# EasyEDA Pro project STLink.eprj

# Schematic Schematic1
Board Name: TYPEC; Create Date: 2025-10-18; Page Name: P1; Project Name: STLink; Schematic Name: Schematic1; Update Date: 2025-10-19; Company: 嘉立创EDA; Page Size: A3; Version: V1.0
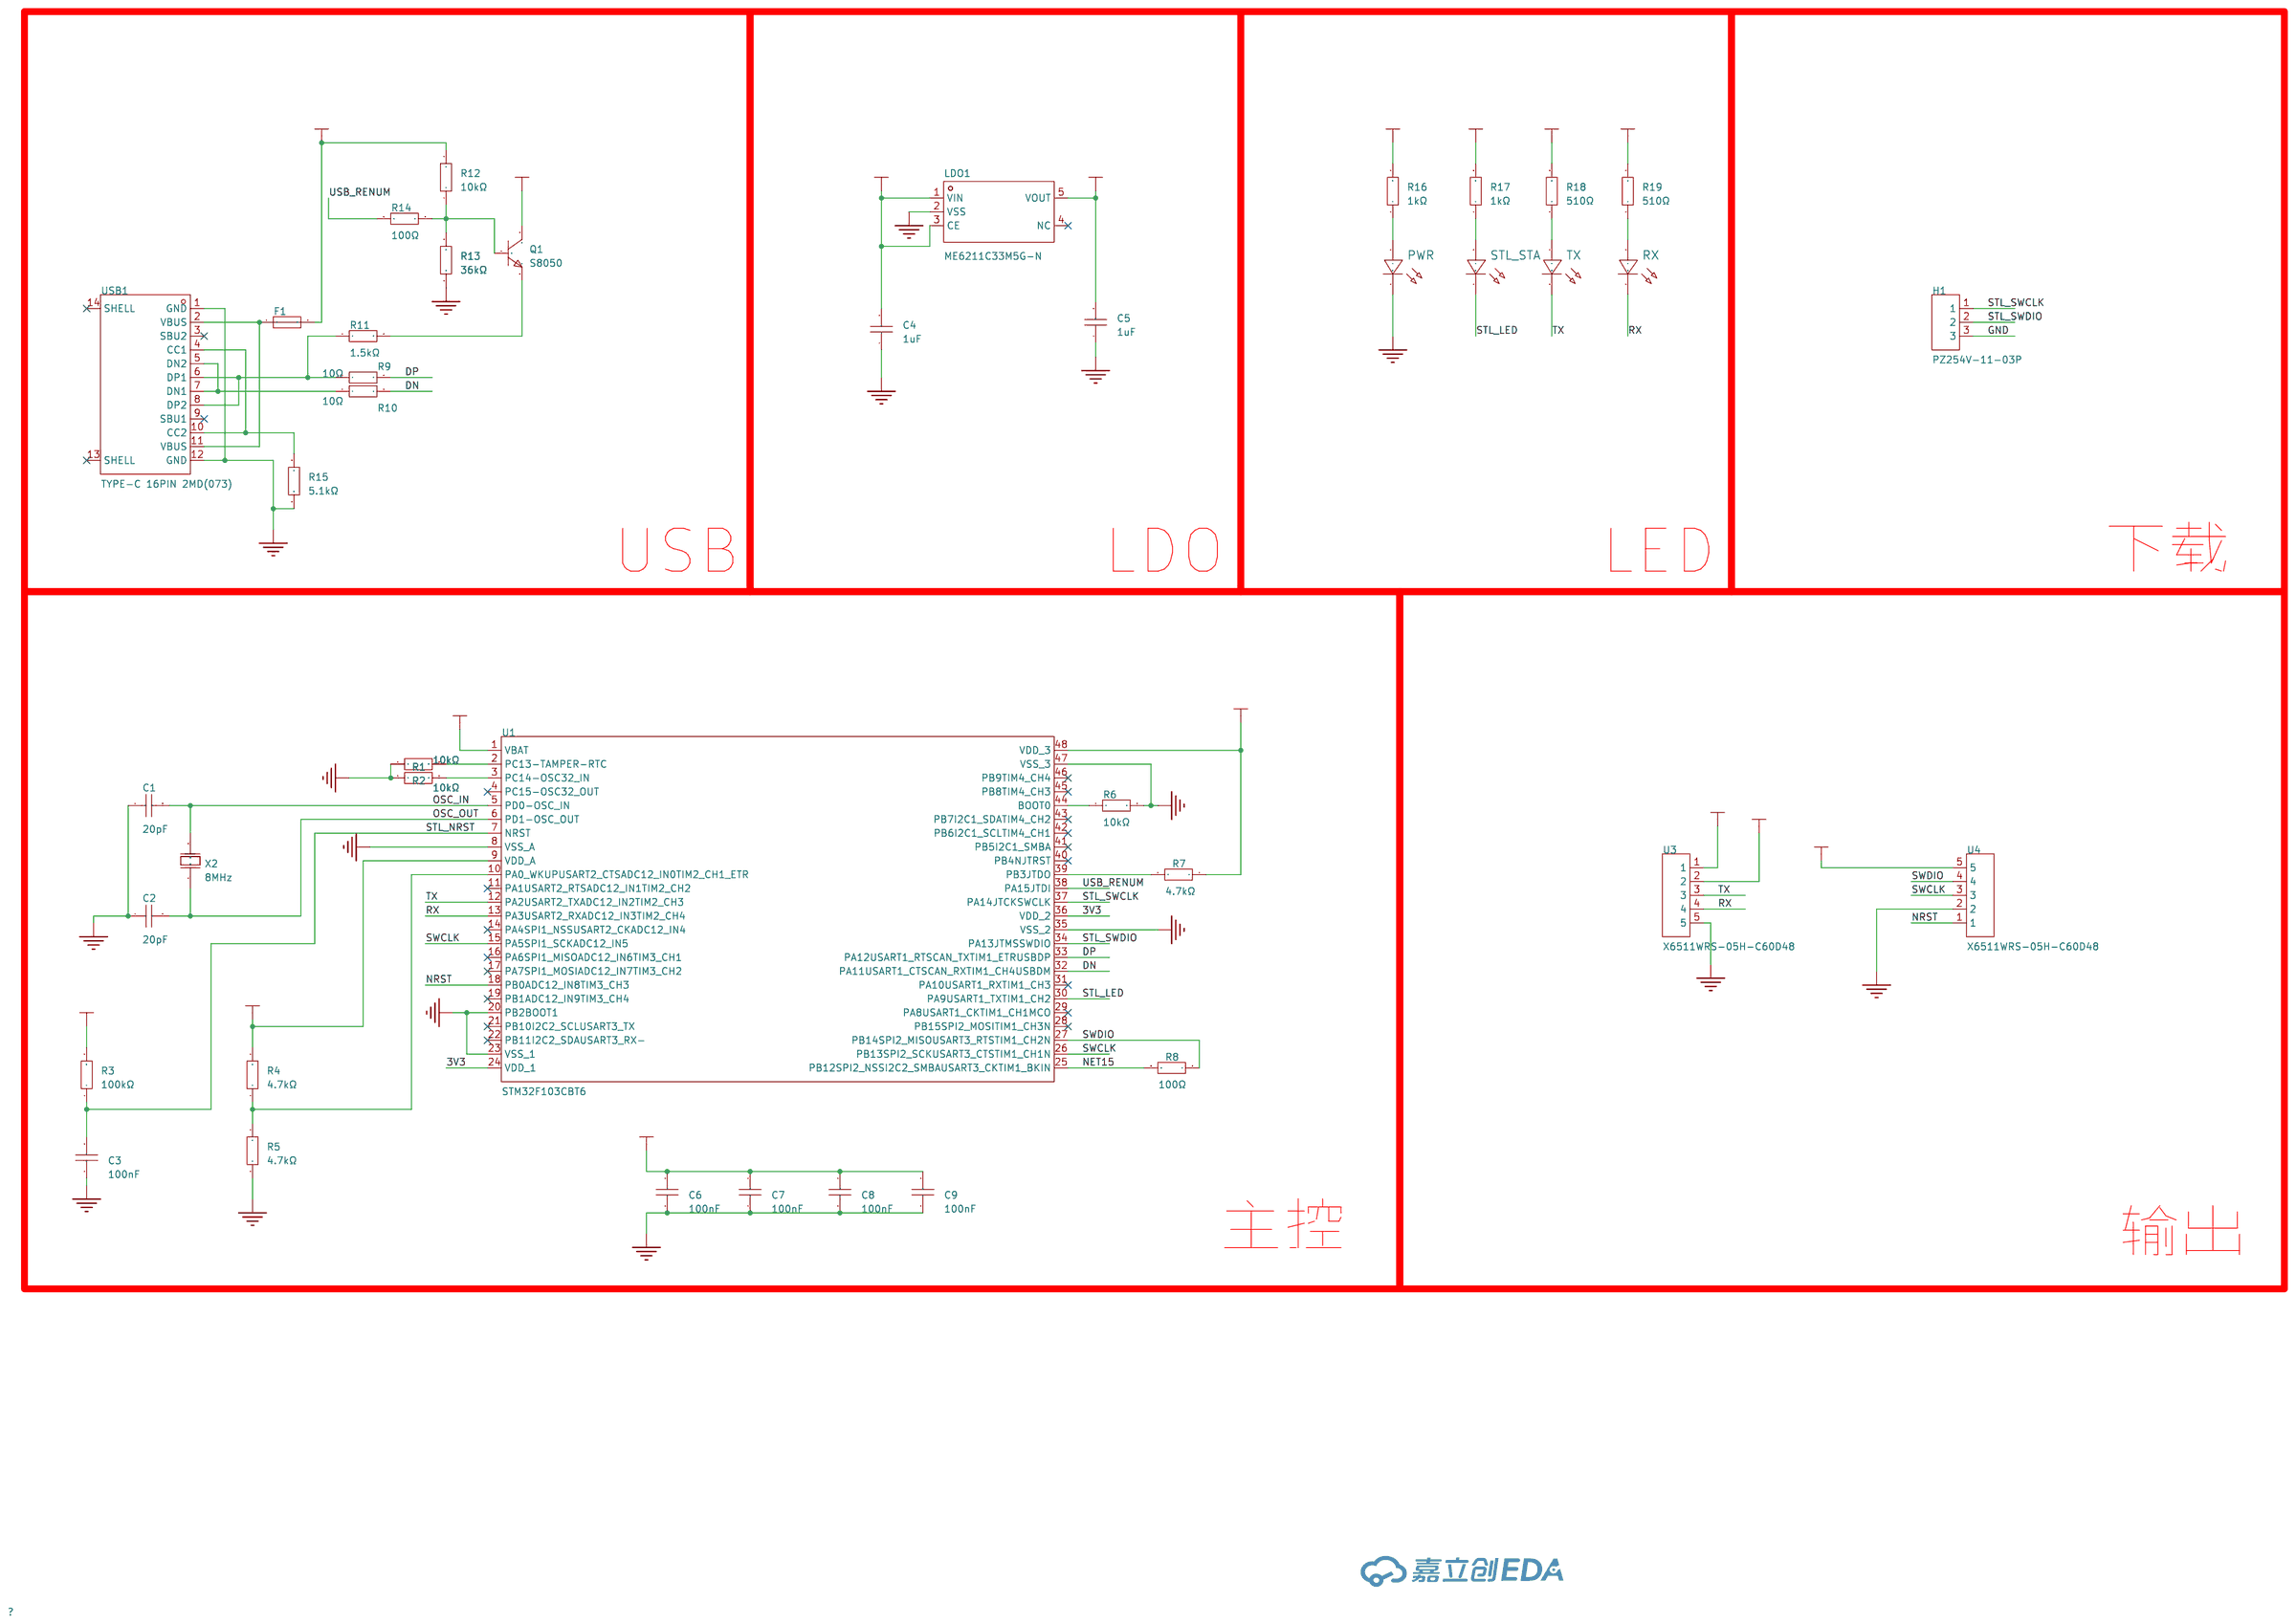
[diagram p0: schematic sheet]

## Parts
C1  20pF  [C0402]
C2  20pF  [C0402]
C3  100nF  [C0402]
C4  1uF  [C0603]
C5  1uF  [C0603]
C6  100nF  [C0402]
C7  100nF  [C0402]
C8  100nF  [C0402]
C9  100nF  [C0402]
F1  MF-FSMF050X-2  [F0603]
H1  PZ254V-11-03P  [HDR-TH_3P-P2.54-V-M]
LDO1  ME6211C33M5G-N  [SOT-23-5_L3.0-W1.7-P0.95-LS2.8-BR]
PWR  -  [LED_0603]
Q1  S8050  [SOT-23-3_L3.0-W1.7-P0.95-LS2.9-BR]
R1  10kΩ  [R0402]
R2  10kΩ  [R0402]
R3  100kΩ  [R0402]
R4  4.7kΩ  [R0402]
R5  4.7kΩ  [R0402]
R6  10kΩ  [R0402]
R7  4.7kΩ  [R0402]
R8  100Ω  [R0402]
R9  10Ω  [R0402]
R10  10Ω  [R0402]
R11  1.5kΩ  [R0402]
R12  10kΩ  [R0402]
R13  36kΩ  [R0402]
R14  100Ω  [R0402]
R15  5.1kΩ  [R0402]
R16  1kΩ  [R0402]
R17  1kΩ  [R0402]
R18  510Ω  [R0402]
R19  510Ω  [R0402]
RX  -  [LED_0603]
STL_STA  -  [LED_0603]
TX  -  [LED_0603]
U1  STM32F103CBT6  [LQFP-48_L7.0-W7.0-P0.50-LS9.0-BL]
U3  X6511WRS-05H-C60D48  [HDR-SMD_5P-P2.54-H-M-W13.3-N]
U4  X6511WRS-05H-C60D48  [HDR-SMD_5P-P2.54-H-M-W13.3-N]
USB1  TYPE-C 16PIN 2MD(073)  [USB-C-SMD_TYPE-C-6PIN-2MD-073]
X2  8MHz  [HC-49US_L11.5-W4.5-P4.88]

## Library data of the parts
C1-C3 C6-C9 = CC0402KRX7R9BB103: LCSC Part Name: 10nF ±10% 50V; Supplier Part: C60133; Manufacturer: YAGEO(国巨); Supplier Footprint: 0402; JLCPCB Part Class: 扩展库; Datasheet: https://atta.szlcsc.com/upload/public/pdf/source/20180224/C181747_15194369449651363981.pdf; Supplier: LCSC; Tolerance: ±10%; Voltage Rated: 50V; Temperature Coefficient: X7R
C4 C5 = CL10A105KB8NNNC: 温度系数:X5R;精度:±10%;额定电压:50V;容值:1uF;; LCSC Part Name: 1uF(105) ±10% 50V; Supplier Part: C15849; Manufacturer: SAMSUNG(三星); Supplier Footprint: 0603; JLCPCB Part Class: Basic Part; Datasheet: https://atta.szlcsc.com/upload/public/pdf/source/20160103/1457707679084.pdf; Supplier: LCSC; Tolerance: ±10%; Voltage Rated: 50V; Temperature Coefficient: X5R
F1 = MF-FSMF050X-2: LCSC Part Name: 6V 500mA; Supplier Part: C210357; Manufacturer: BOURNS; Supplier Footprint: 0603; JLCPCB Part Class: Extended Part; Datasheet: https://atta.szlcsc.com/upload/public/pdf/source/20180524/C210357_26D2BEEFC098B5962B9D8AEB60E1F9FC.pdf; Supplier: LCSC; Operating Voltage (Max): 6V; Current Rating (Max): 40A; Hold Current: 500mA; Trip Current: 1A; Resistance - Initial (Ri) (Min): 100mΩ; Resistance - Post Trip (R1) (Max): 800mΩ; Maximum Time to Trip: 100ms; Operating Temperature: -40℃~+85℃
H1 = PZ254V-11-03P: LCSC Part Name: 1x3P 间距:2.54mm 方针 直插; Supplier Part: C2937625; Manufacturer: XFCN(兴飞); Supplier Footprint: 插件,P=2.54mm; JLCPCB Part Class: 扩展库; Datasheet: https://item.szlcsc.com/datasheet/PZ254V-11-03P/3293280.html; Supplier: LCSC; Pin Structure: 1x3P; Pitch: 2.54mm; Circluar Pins/Square Pins: 方针; Mounting Type: 直插; Number of Rows: 单排; Number of Pins: 3P; Current Rating: 3A; Voltage Rating (Max): 250V; Length of Mating Pin: 6mm; Insulation Height: 2.5mm; Length of End Connection Pin: 3mm; Operating Temperature: -40℃~+105℃; Color: 黑色
LDO1 = ME6211C33M5G-N: 输出类型:固定;输出极性:正;输出通道数:1;最大输入电压:6V;输出电压:3.3V;压差:260mV@(200mA);输出电流:500mA;电源纹波抑制比(PRSS):70dB@(1kHz),62dB@(10kHz);; LCSC Part Name: Vin=6V Vout=3.3V 500mA 70dB@(1kHz),62dB@(10kHz); Supplier Part: C82942; Manufacturer: MICRONE(南京微盟); Supplier Footprint: SOT-23-5; JLCPCB Part Class: Extended Part; Datasheet: https://atta.szlcsc.com/upload/public/pdf/source/20170918/C82942_1505727073070976520.pdf; Supplier: LCSC; Output Type: 固定; Maximum Input Voltage: 6V; Output Voltage: 3.3V; Dropout Voltage: 260mV@(200mA); Output Polarity: 正; Number of Outputs: 1; Output Current: 500mA; Power Supply Rejection Ratio (PRSS): 70dB@(1kHz),62dB@(10kHz)
PWR RX STL_STA TX = LED_0603-R: Supplier Footprint: 0603
Q1 = S8050_C364312: LCSC Part Name: hFE:200-350 NPN 电流:500mA 电压:25V; Supplier Part: C364312; Manufacturer: MDD(辰达半导体); Supplier Footprint: SOT-23; JLCPCB Part Class: 扩展库; Datasheet: https://item.szlcsc.com/datasheet/S8050/338624.html; Supplier: LCSC; type: NPN; Current - Collector(Ic): 500mA; Collector - Emitter Voltage VCEO: 25V; Pd - Power Dissipation: 300mW; Transition frequency(fT): 150MHz; Current - Collector Cutoff: 100nA; Vce Saturation(VCE(sat)): 600mV@500mA,50mA; Operating Temperature: -55℃~+150℃; Emitter-Base Voltage(Vebo): 5V
R1-R19 = 0402WGF1001TCE: LCSC Part Name: 1kΩ ±1% 62.5mW 厚膜电阻; Supplier Part: C11702; Manufacturer: UNI-ROYAL(厚声); Supplier Footprint: 0402; JLCPCB Part Class: 基础库; Datasheet: https://item.szlcsc.com/datasheet/0402WGF1001TCE/12256.html; Supplier: LCSC; Type: 厚膜电阻; Tolerance: ±1%; Power(Watts): 62.5mW; Voltage-Supply(Max): 50V; Temperature Coefficient: ±100ppm/℃; Operating Temperature: -55℃~+155℃
U1 = STM32F103CBT6: LCSC Part Name: 主流增强型ARM Cortex-M3 MCU，具有128 KB Flash、72 MHz CPU、电机控制、USB和CAN; Supplier Part: C8304; Manufacturer: ST(意法半导体); Supplier Footprint: LQFP-48(7x7); JLCPCB Part Class: 扩展库; Datasheet: https://item.szlcsc.com/datasheet/STM32F103CBT6/8796.html; Supplier: LCSC; CPU Core: ARM-M3; CPU Maximum Speed: 72MHz; Program Storage Size: 128KB; Program Memory Type: FLASH; Number of I/O: 37; ADC (Bit): 12bit; Voltage - Supply: 2V~3.6V
U3 U4 = X6511WRS-05H-C60D48: LCSC Part Name: 1x5P 间距:2.54mm 方针; Supplier Part: C5242198; Manufacturer: XKB Connection(中国星坤); Supplier Footprint: SMD,P=2.54mm,卧贴; JLCPCB Part Class: 扩展库; Datasheet: https://item.szlcsc.com/datasheet/X6511WRS-05H-C60D48/5950305.html; Supplier: LCSC; Pin Structure: 1x5P; Pitch: 2.54mm; Row Spacing: 2.54mm; Circluar Pins/Square Pins: 方针; Number of Rows: 单排; Number of Pins: 5P; Current Rating: 3A; Voltage Rating (Max): 250V; Insulation Height: 2.5mm; Contact Material: 黄铜; Contact Plating: 金; Operating Temperature: -40℃~+105℃; Color: 黑色
USB1 = TYPE-C 16PIN 2MD(073): LCSC Part Name: Type-C 母 卧贴; Supplier Part: C2765186; Manufacturer: SHOU HAN(首韩); Supplier Footprint: SMD; JLCPCB Part Class: 扩展库; Datasheet: https://item.szlcsc.com/datasheet/TYPE-C%252016PIN%25202MD(073)/2901843.html; Supplier: LCSC; Connector Type: Type-C; Gender: 母; Mounting Type: 卧贴; Number of Contacts: 16P; Number of Ports: 1; Current Rating-Power: 3A; Voltage Rating: 5V; Connect-Disconnect Life: 5千次; Detection color: 黑色; Operating Temperature: -25℃~+85℃
X2 = X49SD8MSB2SI: LCSC Part Name: HC-49US 8MHZ 2P 49S 20PF ±10PPM -40~85℃（±30PPM); Supplier Part: C188205; Manufacturer: YXC(扬兴晶振); Supplier Footprint: HC-49S; JLCPCB Part Class: 扩展库; Datasheet: https://item.szlcsc.com/datasheet/X49SD8MSB2SI/199611.html; Supplier: LCSC; Type: 直插晶振; Normal temperature Frequency Tolerance: ±10ppm; Load Capacitance: 20pF; Frequency Stability: ±30ppm; Operating Temperature: -40℃~+85℃

## Nets
3V3: C5.2 C6.2 C7.2 C8.2 C9.2 LDO1.5(VOUT) Q1.3(C) R3.2 R4.2 R7.1 R16.2 R17.2 R18.2 R19.2 U1.1(VBAT) U1.9(VDD_A) U1.24(VDD_1) U1.36(VDD_2) U1.48(VDD_3) U3.2 U4.5
5V: C4.2 F1.2 LDO1.1(VIN) LDO1.3(CE) R12.2 U3.1
GND: C1.1 C2.1 C3.1 C4.1 C5.1 C6.1 C7.1 C8.1 C9.1 H1.3 LDO1.2(VSS) PWR.1(C) R1.1 R2.1 R5.1 R6.2 R13.1 R15.1 U1.8(VSS_A) U1.20(PB2BOOT1) U1.23(VSS_1) U1.35(VSS_2) U1.47(VSS_3) U3.5 U4.2 USB1.1(GND) USB1.12(GND)
DN: R10.2 U1.32(PA11USART1_CTSCAN_RXTIM1_CH4USBDM)
DP: R9.2 U1.33(PA12USART1_RTSCAN_TXTIM1_ETRUSBDP)
NET15: R8.2 U1.25(PB12SPI2_NSSI2C2_SMBAUSART3_CKTIM1_BKIN)
NRST: U1.18(PB0ADC12_IN8TIM3_CH3) U4.1
OSC_IN: C1.2 U1.5(PD0-OSC_IN) X2.2(OSC2)
OSC_OUT: C2.2 U1.6(PD1-OSC_OUT) X2.1(OSC1)
RX: RX.1(C) U1.13(PA3USART2_RXADC12_IN3TIM2_CH4) U3.4
STL_LED: STL_STA.1(C) U1.30(PA9USART1_TXTIM1_CH2)
STL_NRST: C3.2 R3.1 U1.7(NRST)
STL_SWCLK: H1.1 U1.37(PA14JTCKSWCLK)
STL_SWDIO: H1.2 U1.34(PA13JTMSSWDIO)
SWCLK: U1.15(PA5SPI1_SCKADC12_IN5) U1.26(PB13SPI2_SCKUSART3_CTSTIM1_CH1N) U4.3
SWDIO: R8.1 U1.27(PB14SPI2_MISOUSART3_RTSTIM1_CH2N) U4.4
TX: TX.1(C) U1.12(PA2USART2_TXADC12_IN2TIM2_CH3) U3.3
USB_RENUM: R14.2 U1.38(PA15JTDI)
$1N527: R1.2 U1.2(PC13-TAMPER-RTC)
$1N531: R2.2 U1.3(PC14-OSC32_IN)
$1N1130: R4.1 R5.2 U1.10(PA0_WKUPUSART2_CTSADC12_IN0TIM2_CH1_ETR)
$1N1287: R6.1 U1.44(BOOT0)
$1N1308: R7.2 U1.39(PB3JTDO)
$1N1874: F1.1 USB1.2(VBUS) USB1.11(VBUS)
$1N1927: R9.1 R11.1 USB1.6(DP1) USB1.8(DP2)
$1N1932: R10.1 USB1.5(DN2) USB1.7(DN1)
$1N2093: Q1.2(E) R11.2
$1N2214: Q1.1(B) R12.1 R13.2 R14.1
$1N2319: R15.2 USB1.4(CC1) USB1.10(CC2)
$1N2779: PWR.2(A) R16.1
$1N2890: R17.1 STL_STA.2(A)
$1N2985: R18.1 TX.2(A)
$1N3080: R19.1 RX.2(A)

Not connected (* = marked no-connect by the designer): LDO1 4(NC)*; U1 4(PC15-OSC32_OUT)* 11(PA1USART2_RTSADC12_IN1TIM2_CH2)* 14(PA4SPI1_NSSUSART2_CKADC12_IN4)* 16(PA6SPI1_MISOADC12_IN6TIM3_CH1)* 17(PA7SPI1_MOSIADC12_IN7TIM3_CH2)* 19(PB1ADC12_IN9TIM3_CH4)* 21(PB10I2C2_SCLUSART3_TX)* 22(PB11I2C2_SDAUSART3_RX-)* 28(PB15SPI2_MOSITIM1_CH3N)* 29(PA8USART1_CKTIM1_CH1MCO)* 31(PA10USART1_RXTIM1_CH3)* 40(PB4NJTRST)* 41(PB5I2C1_SMBA)* 42(PB6I2C1_SCLTIM4_CH1)* 43(PB7I2C1_SDATIM4_CH2)* 45(PB8TIM4_CH3)* 46(PB9TIM4_CH4)*; USB1 3(SBU2)* 9(SBU1)* 13(SHELL)* 14(SHELL)*

## Notes on the sheet
- USB
- LDO
- LED
- 下载
- 主控
- 输出

# Schematic Schematic2
Board Name: USB; Create Date: 2025-10-20; Page Name: P1; Project Name: STLink; Schematic Name: Schematic2; Update Date: 2025-10-20; Company: 嘉立创EDA; Page Size: A4; Version: V1.0
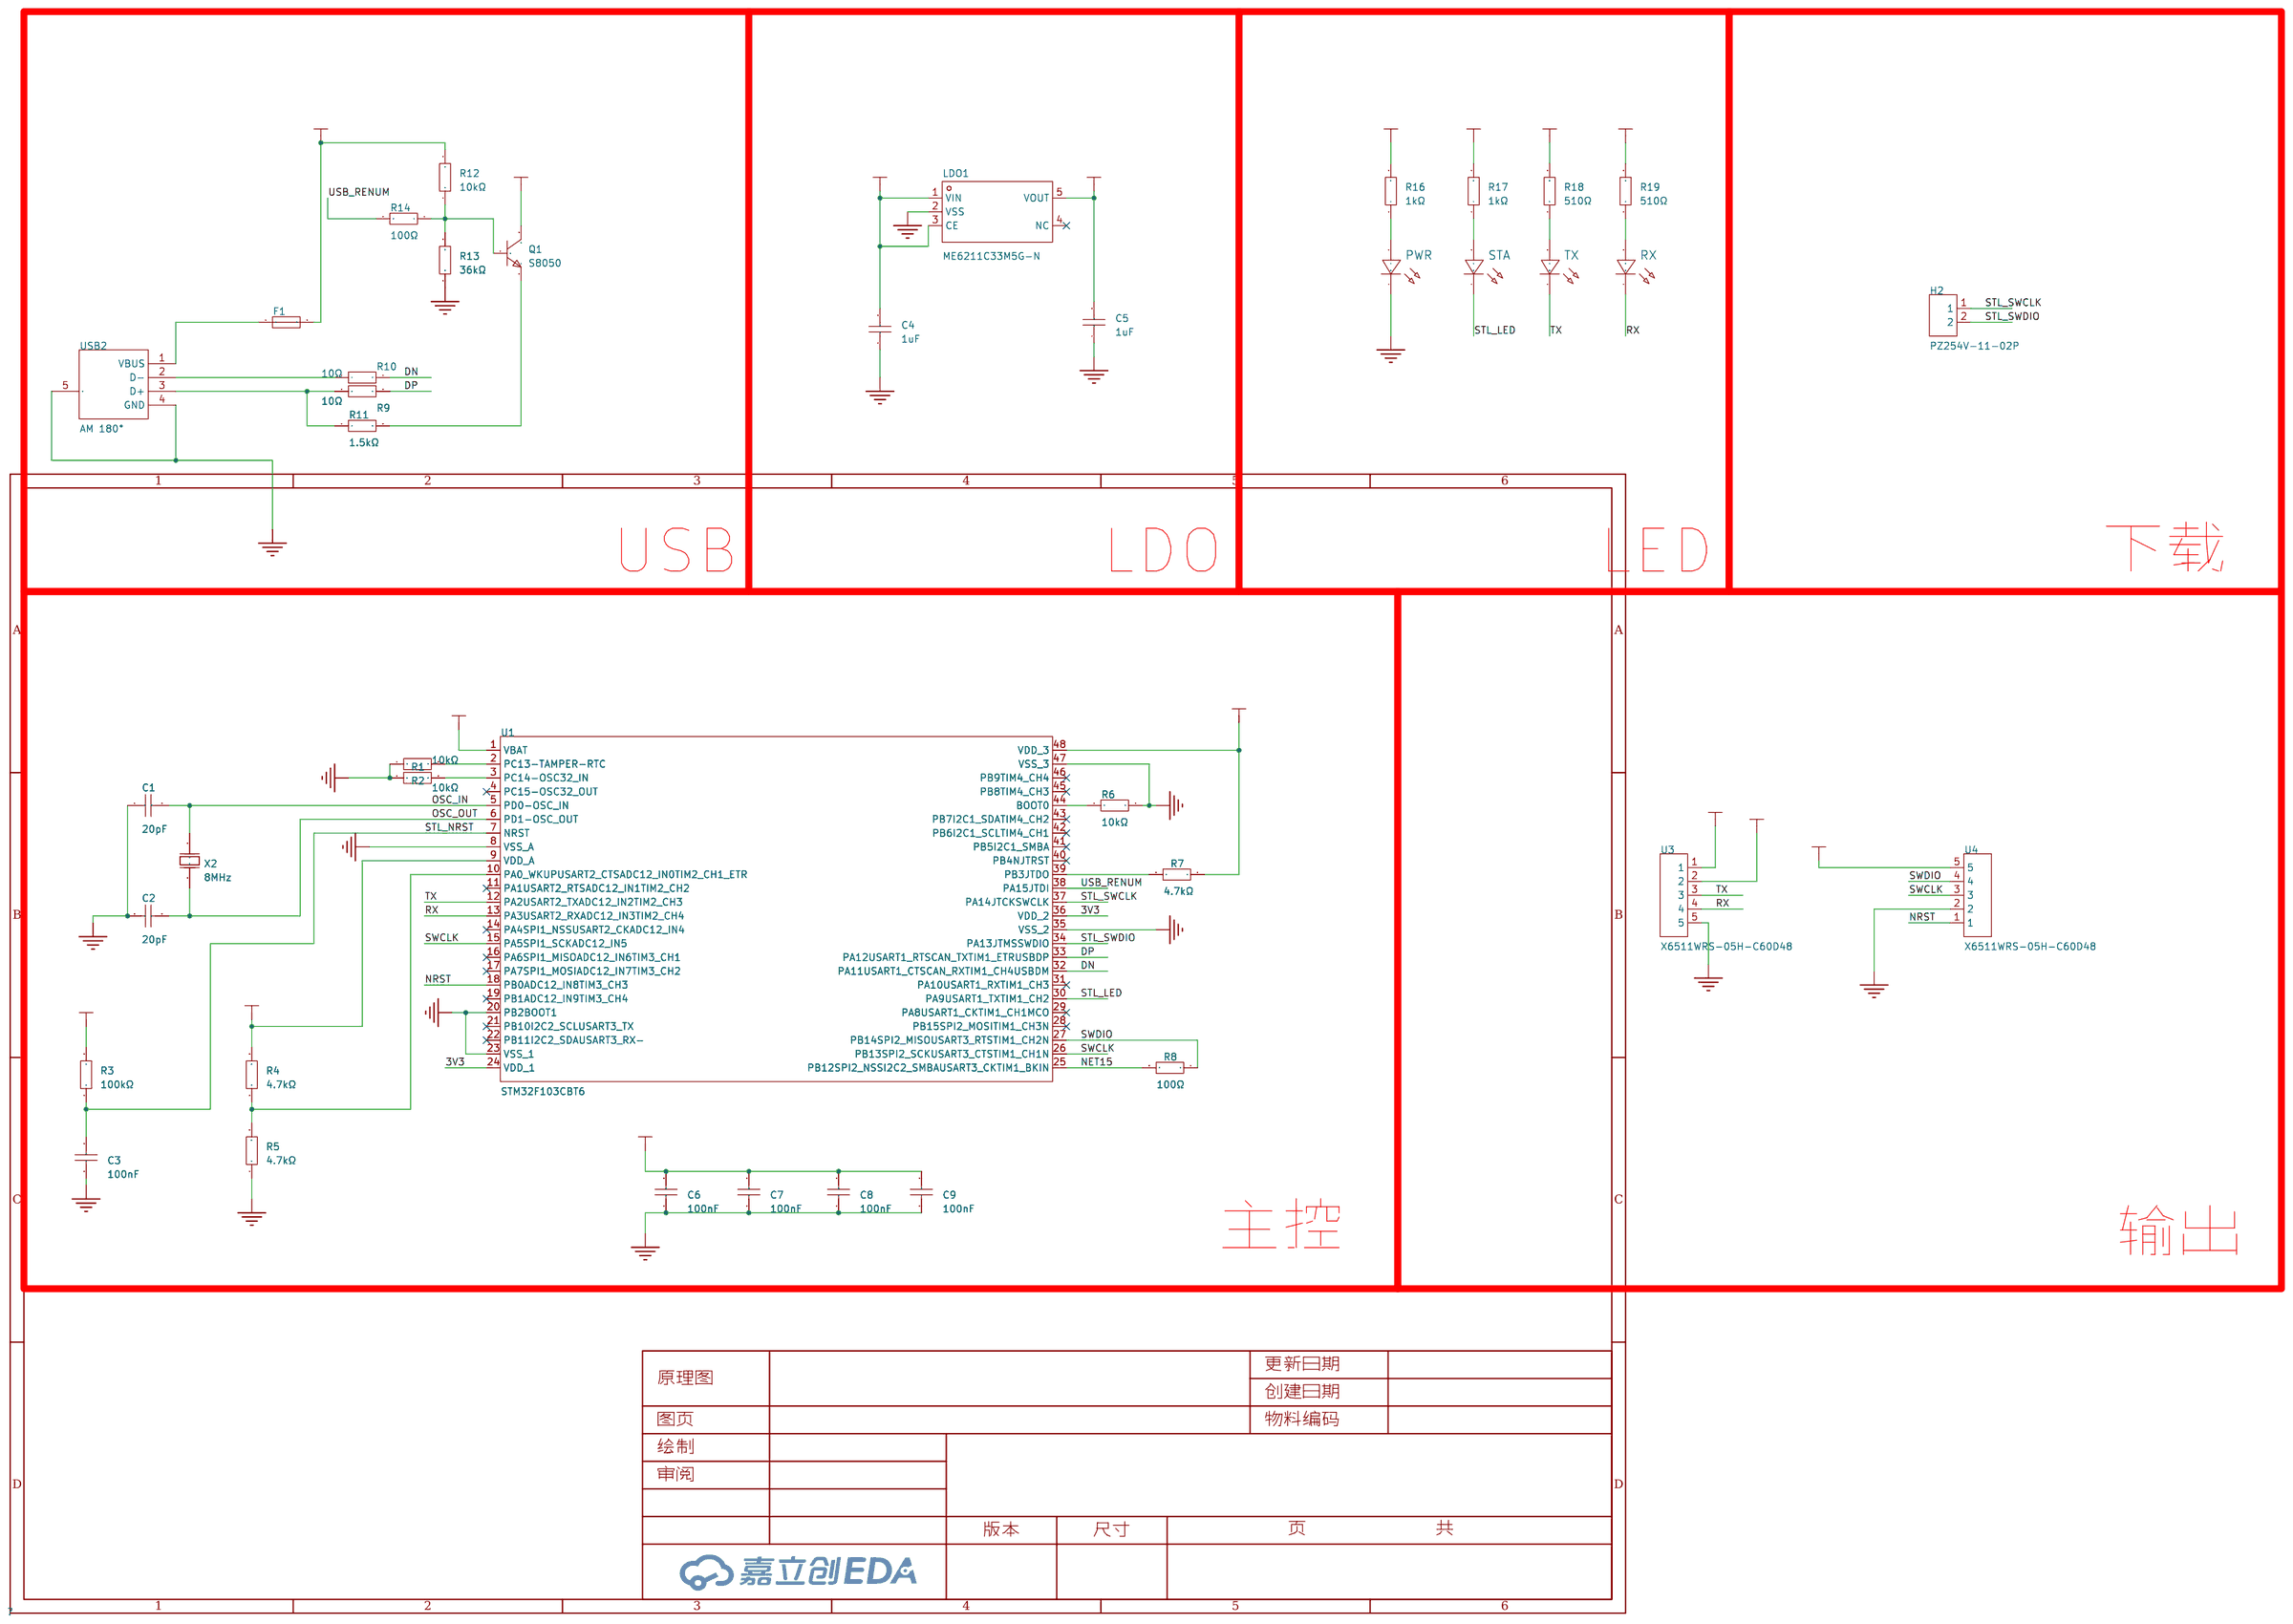
[diagram p1: schematic sheet]

## Parts
C1  20pF  [C0402]
C2  20pF  [C0402]
C3  100nF  [C0402]
C4  1uF  [C0603]
C5  1uF  [C0603]
C6  100nF  [C0402]
C7  100nF  [C0402]
C8  100nF  [C0402]
C9  100nF  [C0402]
F1  MF-FSMF050X-2  [F0603]
H2  PZ254V-11-02P  [HDR-TH_2P-P2.54-V-M]
LDO1  ME6211C33M5G-N  [SOT-23-5_L3.0-W1.7-P0.95-LS2.8-BR]
PWR  -  [LED_0603]
Q1  S8050  [SOT-23-3_L3.0-W1.7-P0.95-LS2.9-BR]
R1  10kΩ  [R0402]
R2  10kΩ  [R0402]
R3  100kΩ  [R0402]
R4  4.7kΩ  [R0402]
R5  4.7kΩ  [R0402]
R6  10kΩ  [R0402]
R7  4.7kΩ  [R0402]
R8  100Ω  [R0402]
R9  10Ω  [R0402]
R10  10Ω  [R0402]
R11  1.5kΩ  [R0402]
R12  10kΩ  [R0402]
R13  36kΩ  [R0402]
R14  100Ω  [R0402]
R16  1kΩ  [R0402]
R17  1kΩ  [R0402]
R18  510Ω  [R0402]
R19  510Ω  [R0402]
RX  -  [LED_0603]
STA  -  [LED_0603]
TX  -  [LED_0603]
U1  STM32F103CBT6  [LQFP-48_L7.0-W7.0-P0.50-LS9.0-BL]
U3  X6511WRS-05H-C60D48  [HDR-SMD_5P-P2.54-H-M-W13.3-N]
U4  X6511WRS-05H-C60D48  [HDR-SMD_5P-P2.54-H-M-W13.3-N]
USB2  AM 180°  [USB-SMD_AM180]
X2  8MHz  [HC-49US_L11.5-W4.5-P4.88]

## Library data of the parts
C1-C3 C6-C9 = CC0402KRX7R9BB103: LCSC Part Name: 10nF ±10% 50V; Supplier Part: C60133; Manufacturer: YAGEO(国巨); Supplier Footprint: 0402; JLCPCB Part Class: 扩展库; Datasheet: https://atta.szlcsc.com/upload/public/pdf/source/20180224/C181747_15194369449651363981.pdf; Supplier: LCSC; Tolerance: ±10%; Voltage Rated: 50V; Temperature Coefficient: X7R
C4 C5 = CL10A105KB8NNNC: 温度系数:X5R;精度:±10%;额定电压:50V;容值:1uF;; LCSC Part Name: 1uF(105) ±10% 50V; Supplier Part: C15849; Manufacturer: SAMSUNG(三星); Supplier Footprint: 0603; JLCPCB Part Class: Basic Part; Datasheet: https://atta.szlcsc.com/upload/public/pdf/source/20160103/1457707679084.pdf; Supplier: LCSC; Tolerance: ±10%; Voltage Rated: 50V; Temperature Coefficient: X5R
F1 = MF-FSMF050X-2: LCSC Part Name: 6V 500mA; Supplier Part: C210357; Manufacturer: BOURNS; Supplier Footprint: 0603; JLCPCB Part Class: Extended Part; Datasheet: https://atta.szlcsc.com/upload/public/pdf/source/20180524/C210357_26D2BEEFC098B5962B9D8AEB60E1F9FC.pdf; Supplier: LCSC; Operating Voltage (Max): 6V; Current Rating (Max): 40A; Hold Current: 500mA; Trip Current: 1A; Resistance - Initial (Ri) (Min): 100mΩ; Resistance - Post Trip (R1) (Max): 800mΩ; Maximum Time to Trip: 100ms; Operating Temperature: -40℃~+85℃
H2 = PZ254V-11-02P: LCSC Part Name: 1x2P 间距:2.54mm 方针 直插; Supplier Part: C492401; Manufacturer: XFCN(兴飞); Supplier Footprint: 插件,P=2.54mm; Datasheet: https://item.szlcsc.com/datasheet/PZ254V-11-02P/502957.html; Supplier: LCSC; Pin Structure: 1x2P; Pitch: 2.54mm; Circluar Pins/Square Pins: 方针; Mounting Type: 直插; Number of Rows: 单排; Number of Pins: 2P; Length of Mating Pin: 6mm; Insulation Height: 2.5mm; Length of End Connection Pin: 3mm; Contact Material: 黄铜; Operating Temperature: -40℃~+105℃; Color: 黑色
LDO1 = ME6211C33M5G-N: 输出类型:固定;输出极性:正;输出通道数:1;最大输入电压:6V;输出电压:3.3V;压差:260mV@(200mA);输出电流:500mA;电源纹波抑制比(PRSS):70dB@(1kHz),62dB@(10kHz);; LCSC Part Name: Vin=6V Vout=3.3V 500mA 70dB@(1kHz),62dB@(10kHz); Supplier Part: C82942; Manufacturer: MICRONE(南京微盟); Supplier Footprint: SOT-23-5; JLCPCB Part Class: Extended Part; Datasheet: https://atta.szlcsc.com/upload/public/pdf/source/20170918/C82942_1505727073070976520.pdf; Supplier: LCSC; Output Type: 固定; Maximum Input Voltage: 6V; Output Voltage: 3.3V; Dropout Voltage: 260mV@(200mA); Output Polarity: 正; Number of Outputs: 1; Output Current: 500mA; Power Supply Rejection Ratio (PRSS): 70dB@(1kHz),62dB@(10kHz)
PWR RX STA TX = LED_0603-R: Supplier Footprint: 0603
Q1 = S8050_C364312: LCSC Part Name: hFE:200-350 NPN 电流:500mA 电压:25V; Supplier Part: C364312; Manufacturer: MDD(辰达半导体); Supplier Footprint: SOT-23; JLCPCB Part Class: 扩展库; Datasheet: https://item.szlcsc.com/datasheet/S8050/338624.html; Supplier: LCSC; type: NPN; Current - Collector(Ic): 500mA; Collector - Emitter Voltage VCEO: 25V; Pd - Power Dissipation: 300mW; Transition frequency(fT): 150MHz; Current - Collector Cutoff: 100nA; Vce Saturation(VCE(sat)): 600mV@500mA,50mA; Operating Temperature: -55℃~+150℃; Emitter-Base Voltage(Vebo): 5V
R1-R14 R16-R19 = 0402WGF1001TCE: LCSC Part Name: 1kΩ ±1% 62.5mW 厚膜电阻; Supplier Part: C11702; Manufacturer: UNI-ROYAL(厚声); Supplier Footprint: 0402; JLCPCB Part Class: 基础库; Datasheet: https://item.szlcsc.com/datasheet/0402WGF1001TCE/12256.html; Supplier: LCSC; Type: 厚膜电阻; Tolerance: ±1%; Power(Watts): 62.5mW; Voltage-Supply(Max): 50V; Temperature Coefficient: ±100ppm/℃; Operating Temperature: -55℃~+155℃
U1 = STM32F103CBT6: LCSC Part Name: 主流增强型ARM Cortex-M3 MCU，具有128 KB Flash、72 MHz CPU、电机控制、USB和CAN; Supplier Part: C8304; Manufacturer: ST(意法半导体); Supplier Footprint: LQFP-48(7x7); JLCPCB Part Class: 扩展库; Datasheet: https://item.szlcsc.com/datasheet/STM32F103CBT6/8796.html; Supplier: LCSC; CPU Core: ARM-M3; CPU Maximum Speed: 72MHz; Program Storage Size: 128KB; Program Memory Type: FLASH; Number of I/O: 37; ADC (Bit): 12bit; Voltage - Supply: 2V~3.6V
U3 U4 = X6511WRS-05H-C60D48: LCSC Part Name: 1x5P 间距:2.54mm 方针; Supplier Part: C5242198; Manufacturer: XKB Connection(中国星坤); Supplier Footprint: SMD,P=2.54mm,卧贴; JLCPCB Part Class: 扩展库; Datasheet: https://item.szlcsc.com/datasheet/X6511WRS-05H-C60D48/5950305.html; Supplier: LCSC; Pin Structure: 1x5P; Pitch: 2.54mm; Row Spacing: 2.54mm; Circluar Pins/Square Pins: 方针; Number of Rows: 单排; Number of Pins: 5P; Current Rating: 3A; Voltage Rating (Max): 250V; Insulation Height: 2.5mm; Contact Material: 黄铜; Contact Plating: 金; Operating Temperature: -40℃~+105℃; Color: 黑色
USB2 = AM 180°: LCSC Part Name: Type-A 公 卧贴; Supplier Part: C2681564; Manufacturer: SHOU HAN(首韩); Supplier Footprint: SMD; JLCPCB Part Class: 扩展库; Datasheet: https://item.szlcsc.com/datasheet/AM%2520180%25C2%25B0/2774907.html; Supplier: LCSC; Connector Type: Type-A; Protocol Standard: USB 2.0; Gender: 公; Mounting Type: 卧贴; Number of Contacts: 4P; Number of Ports: 1; Current Rating-Power: 1.5A; Voltage Rating: 30V; Connect-Disconnect Life: 5千次; Length: 18.8mm; Detection color: 白色; Operating Temperature: -25℃~+85℃
X2 = X49SD8MSB2SI: LCSC Part Name: HC-49US 8MHZ 2P 49S 20PF ±10PPM -40~85℃（±30PPM); Supplier Part: C188205; Manufacturer: YXC(扬兴晶振); Supplier Footprint: HC-49S; JLCPCB Part Class: 扩展库; Datasheet: https://item.szlcsc.com/datasheet/X49SD8MSB2SI/199611.html; Supplier: LCSC; Type: 直插晶振; Normal temperature Frequency Tolerance: ±10ppm; Load Capacitance: 20pF; Frequency Stability: ±30ppm; Operating Temperature: -40℃~+85℃

## Nets
3V3: C5.2 C6.2 C7.2 C8.2 C9.2 LDO1.5(VOUT) Q1.3(C) R3.2 R4.2 R7.1 R16.2 R17.2 R18.2 R19.2 U1.1(VBAT) U1.9(VDD_A) U1.24(VDD_1) U1.36(VDD_2) U1.48(VDD_3) U3.2 U4.5
5V: C4.2 F1.2 LDO1.1(VIN) LDO1.3(CE) R12.2 U3.1
GND: C1.1 C2.1 C3.1 C4.1 C5.1 C6.1 C7.1 C8.1 C9.1 LDO1.2(VSS) PWR.1(C) R1.1 R2.1 R5.1 R6.2 R13.1 U1.8(VSS_A) U1.20(PB2BOOT1) U1.23(VSS_1) U1.35(VSS_2) U1.47(VSS_3) U3.5 U4.2 USB2.4(GND) USB2.5(EH)
DN: R10.2 U1.32(PA11USART1_CTSCAN_RXTIM1_CH4USBDM)
DP: R9.2 U1.33(PA12USART1_RTSCAN_TXTIM1_ETRUSBDP)
NET15: R8.2 U1.25(PB12SPI2_NSSI2C2_SMBAUSART3_CKTIM1_BKIN)
NRST: U1.18(PB0ADC12_IN8TIM3_CH3) U4.1
OSC_IN: C1.2 U1.5(PD0-OSC_IN) X2.2(OSC2)
OSC_OUT: C2.2 U1.6(PD1-OSC_OUT) X2.1(OSC1)
RX: RX.1(C) U1.13(PA3USART2_RXADC12_IN3TIM2_CH4) U3.4
STL_LED: STA.1(C) U1.30(PA9USART1_TXTIM1_CH2)
STL_NRST: C3.2 R3.1 U1.7(NRST)
STL_SWCLK: H2.1 U1.37(PA14JTCKSWCLK)
STL_SWDIO: H2.2 U1.34(PA13JTMSSWDIO)
SWCLK: U1.15(PA5SPI1_SCKADC12_IN5) U1.26(PB13SPI2_SCKUSART3_CTSTIM1_CH1N) U4.3
SWDIO: R8.1 U1.27(PB14SPI2_MISOUSART3_RTSTIM1_CH2N) U4.4
TX: TX.1(C) U1.12(PA2USART2_TXADC12_IN2TIM2_CH3) U3.3
USB_RENUM: R14.2 U1.38(PA15JTDI)
$1N2138: R1.2 U1.2(PC13-TAMPER-RTC)
$1N2139: R2.2 U1.3(PC14-OSC32_IN)
$1N2152: R4.1 R5.2 U1.10(PA0_WKUPUSART2_CTSADC12_IN0TIM2_CH1_ETR)
$1N2164: R6.1 U1.44(BOOT0)
$1N2166: R7.2 U1.39(PB3JTDO)
$1N2184: F1.1 USB2.1(VBUS)
$1N2186: R10.1 USB2.2(D-)
$1N2192: Q1.2(E) R11.2
$1N2194: Q1.1(B) R12.1 R13.2 R14.1
$1N2208: PWR.2(A) R16.1
$1N2211: R17.1 STA.2(A)
$1N2215: R18.1 TX.2(A)
$1N2219: R19.1 RX.2(A)
$1N2547: R9.1 R11.1 USB2.3(D+)

Not connected (* = marked no-connect by the designer): LDO1 4(NC)*; U1 4(PC15-OSC32_OUT)* 11(PA1USART2_RTSADC12_IN1TIM2_CH2)* 14(PA4SPI1_NSSUSART2_CKADC12_IN4)* 16(PA6SPI1_MISOADC12_IN6TIM3_CH1)* 17(PA7SPI1_MOSIADC12_IN7TIM3_CH2)* 19(PB1ADC12_IN9TIM3_CH4)* 21(PB10I2C2_SCLUSART3_TX)* 22(PB11I2C2_SDAUSART3_RX-)* 28(PB15SPI2_MOSITIM1_CH3N)* 29(PA8USART1_CKTIM1_CH1MCO)* 31(PA10USART1_RXTIM1_CH3)* 40(PB4NJTRST)* 41(PB5I2C1_SMBA)* 42(PB6I2C1_SCLTIM4_CH1)* 43(PB7I2C1_SDATIM4_CH2)* 45(PB8TIM4_CH3)* 46(PB9TIM4_CH4)*

## Notes on the sheet
- USB
- LDO
- LED
- 下载
- 主控
- 输出

# Board PCB1
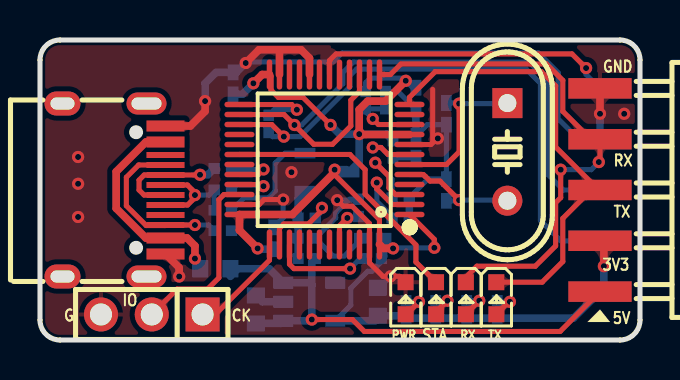
[diagram p2: board, top side]
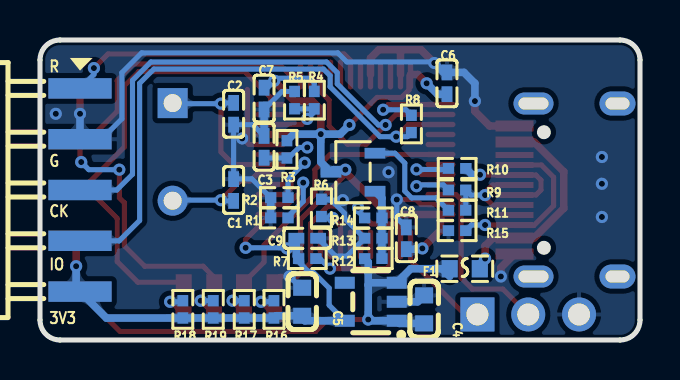
[diagram p3: board, bottom side, seen from below]

Outline 30 x 15 mm; copper layers: Top Layer, Bottom Layer. Coordinates in mm from the lower left corner of the outline.
Outline path: 0,14 0,1 arc(0.29,0.29) 1,0 29,0 arc(29.71,0.29) 30,1 30,14 arc(29.71,14.71) 29,15 1,15 arc(0.29,14.71) 0,14
Stack: Top Layer 0.035mm / Dielectric1 1.51mm FR4 er 4.5 / Bottom Layer 0.035mm

## Design rules (mm)
template: JLCPCB Capability(Two Layers Board)
spacing copperThickness1oz (default): track to track 0.102, other pairs 0.152 to 0.3
spacing copperThickness2oz: track to track 0.203, other pairs 0.152 to 0.3
track width copperThickness1oz (default): min 0.127, default 0.254, max 2.54
track width copperThickness2oz: min 0.203, default 0.254, max 2.54
differential pair differentialPair (default): width min 0.127, default 0.254, max 2.54; gap min 0.152, default 0.152
via viaSize (default): diameter min 0.5, default 0.61, max 10; hole min 0.3, default 0.305, max 6.3

## Placement (name value [footprint] x y rotation side)
C1  20pF  [C0402]  20.32 7.5 270 bottom
C2  20pF  [C0402]  20.32 11.31 90 bottom
C3  100nF  [C0402]  18.8 9.66 270 bottom
C4  1uF  [C0603]  10.79 1.53 270 bottom
C5  1uF  [C0603]  16.89 1.91 270 bottom
C6  100nF  [C0402]  9.65 12.83 270 bottom
C7  100nF  [C0402]  18.8 12.07 90 bottom
C8  100nF  [C0402]  11.68 5.09 270 bottom
C9  100nF  [C0402]  16.64 5.09 0 bottom
F1  MF-FSMF050X-2  [F0603]  8.76 3.56 0 bottom
H1  PZ254V-11-03P  [HDR-TH_3P-P2.54-V-M]  5.59 1.28 180 top
LDO1  ME6211C33M5G-N  [SOT-23-5_L3.0-W1.7-P0.95-LS2.8-BR]  13.46 1.91 180 bottom
PWR  -  [LED_0603]  18.29 2.04 270 top
Q1  S8050  [SOT-23-3_L3.0-W1.7-P0.95-LS2.9-BR]  14.35 8.39 180 bottom
R1  10kΩ  [R0402]  18.03 6.1 180 bottom
R2  10kΩ  [R0402]  18.03 7.12 180 bottom
R3  100kΩ  [R0402]  17.65 9.53 90 bottom
R4  4.7kΩ  [R0402]  16.29 11.99 90 bottom
R5  4.7kΩ  [R0402]  17.27 11.99 270 bottom
R6  10kΩ  [R0402]  15.93 6.61 90 bottom
R7  4.7kΩ  [R0402]  16.64 4.07 180 bottom
R8  100Ω  [R0402]  11.43 10.8 90 bottom
R9  10Ω  [R0402]  9.14 7.5 0 bottom
R10  10Ω  [R0402]  9.14 8.58 0 bottom
R11  1.5kΩ  [R0402]  9.14 6.48 0 bottom
R12  10kΩ  [R0402]  13.34 4.07 0 bottom
R13  36kΩ  [R0402]  13.34 5.09 180 bottom
R14  100Ω  [R0402]  13.34 6.1 0 bottom
R15  5.1kΩ  [R0402]  9.14 5.47 180 bottom
R16  1kΩ  [R0402]  18.3 1.53 270 bottom
R17  1kΩ  [R0402]  19.79 1.53 270 bottom
R18  510Ω  [R0402]  22.86 1.53 270 bottom
R19  510Ω  [R0402]  21.34 1.53 270 bottom
RX  -  [LED_0603]  21.3 2.04 270 top
STL_STA  -  [LED_0603]  19.81 2.04 270 top
TX  -  [LED_0603]  22.83 2.04 270 top
U1  STM32F103CBT6  [LQFP-48_L7.0-W7.0-P0.50-LS9.0-BL]  14.22 9.02 90 top
U3  X6511WRS-05H-C60D48  [HDR-SMD_5P-P2.54-H-M-W13.3-N]  28 7.5 90 top
U4  X6511WRS-05H-C60D48  [HDR-SMD_5P-P2.54-H-M-W13.3-N]  28 7.5 270 bottom
USB1  TYPE-C 16PIN 2MD(073)  [USB-C-SMD_TYPE-C-6PIN-2MD-073]  3.5 7.5 270 top
X2  8MHz  [HC-49US_L11.5-W4.5-P4.88]  23.37 9.41 270 top

## Footprints (pads in the part's own frame, mm; a bottom-side part is the same pattern mirrored in y, then rotated)
C0402
  rect 0.79x0.54 smd: 1(-0.545,0) 2(0.545,0)
C0603
  rect 0.8x0.9 smd: 1(-0.7,0) 2(0.7,0)
F0603
  rect 0.806x0.864 smd: 1(-0.753,0) 2(0.753,0)
HC-49US_L11.5-W4.5-P4.88
  rect 1.5x1.5 hole 0.9: 1(-2.44,0)
  round 1.5 hole 0.9: 2(2.44,0)
HDR-SMD_5P-P2.54-H-M-W13.3-N
  rect 1.02x3.16 smd: 1(-5.08,0) 2(-2.54,0) 3(0,0) 4(2.54,0) 5(5.08,0)
HDR-TH_3P-P2.54-V-M
  rect 1.7x1.7 hole 1.1: 1(-2.54,0)
  round 1.7 hole 1.1: 2(0,0) 3(2.54,0)
LED_0603
  rect 0.8x0.8 smd: 1(-0.851,-0.01) 2(0.75,-0.005)
LQFP-48_L7.0-W7.0-P0.50-LS9.0-BL
  oval 0.27x1.5 smd: 1(-2.75,-4.25) 2(-2.25,-4.25) 3(-1.75,-4.25) 4(-1.25,-4.25) 5(-0.75,-4.25) 6(-0.25,-4.25) 7(0.25,-4.25) 8(0.75,-4.25) 9(1.25,-4.25) 10(1.75,-4.25) 11(2.25,-4.25) 12(2.75,-4.25) 25(2.75,4.25) 26(2.25,4.25) 27(1.75,4.25) 28(1.25,4.25) 29(0.75,4.25) 30(0.25,4.25) 31(-0.25,4.25) 32(-0.75,4.25) 33(-1.25,4.25) 34(-1.75,4.25) 35(-2.25,4.25) 36(-2.75,4.25)
  oval 1.5x0.27 smd: 13(4.25,-2.75) 14(4.25,-2.25) 15(4.25,-1.75) 16(4.25,-1.25) 17(4.25,-0.75) 18(4.25,-0.25) 19(4.25,0.25) 20(4.25,0.75) 21(4.25,1.25) 22(4.25,1.75) 23(4.25,2.25) 24(4.25,2.75) 37(-4.25,2.75) 38(-4.25,2.25) 39(-4.25,1.75) 40(-4.25,1.25) 41(-4.25,0.75) 42(-4.25,0.25) 43(-4.25,-0.25) 44(-4.25,-0.75) 45(-4.25,-1.25) 46(-4.25,-1.75) 47(-4.25,-2.25) 48(-4.25,-2.75)
R0402
  rect 0.566x0.54 smd: 1(-0.433,0) 2(0.433,0)
SOT-23-3_L3.0-W1.7-P0.95-LS2.9-BR
  rect 1.038x0.532 smd: 1(1.101,-0.95) 2(1.101,0.95) 3(-1.101,0)
SOT-23-5_L3.0-W1.7-P0.95-LS2.8-BR
  rect 1x0.6 smd: 1(1.3,-0.95) 2(1.3,0) 3(1.3,0.95) 4(-1.3,0.95) 5(-1.3,-0.95)
USB-C-SMD_TYPE-C-6PIN-2MD-073
  rect 0.55x1.9 smd: 1(-3.2,2.775) 2(-2.4,2.775) 11(2.4,2.775) 12(3.2,2.775)
  rect 0.3x1.9 smd: 3(-1.75,2.775) 4(-1.25,2.775) 5(-0.75,2.775) 6(-0.25,2.775) 7(0.25,2.775) 8(0.75,2.775) 9(1.25,2.775) 10(1.75,2.775)
  oval 1.1x2 hole 0.6x1.5: 13(-4.325,1.825) 14(4.325,1.825)
  oval 1.2x1.8 hole 0.6x1.2: 13(-4.325,-2.375) 14(4.325,-2.375)

## Nets
As in the schematic.

Pads without a net: LDO1 4; U1 4 11 14 16 17 19 21 22 28 29 31 40 41 42 43 45 46; USB1 3 9 13 14

## Via types
v1: diameter 0.61, hole 0.305, Top Layer to Bottom Layer, 48 vias

## Routing (per net, layer and track width the routed paths; a pad name or vN(x,y) marks a point on that pad's centre or on a via; arc(x,y) is an arc through that point)
3V3: length 63.9
  Top Layer w0.254: U1.1 19.72,5.03 v1(19.72,4.61) ; U1.24 11.55,13.19 11.55,12.49 11.92,12.13 13.15,12.13 v1(14.53,10.75) ; U1.48 16.97,6.02 14.73,8.26 14.73,8.39
  Top Layer w0.381: v1(14.73,8.52) 14.73,8.39 12.62,6.27 U1.36 9.97,5.49 v1(10.88,4.58) ; U1.24 11.11,13.27 v1(10.67,12.83) ; v1(18.29,12.96) 17.27,11.94 16.38,11.94 15.96,11.52 v1(15.96,10.29) 15.98,10.27 U1.9 ; v1(17.65,4.58) 17.17,4.58 U1.48 ; v1(28.19,3.69) 28.19,4.77 U3.2
  Bottom Layer w0.254: R7.1 17.15,3.99 16.59,3.44 16.38,3.44 15.54,2.59 15.54,1.74 LDO1.5 ; 17.18,5.05 v1(17.65,4.58) 17.69,4.61 v1(19.72,4.61) ; R4.2 16.29,12.87 16.5,13.09 18.16,13.09 v1(18.29,12.96) 18.63,12.62 C7.2
  Bottom Layer w0.381: R3.2 17.32,10.29 v1(15.96,10.29) ; C6.2 10.12,12.29 v1(10.67,12.83) ; v1(15.96,10.29) 15.96,8.9 Q1.3 15.33,8.52 v1(14.73,8.52) ; v1(15.96,10.29) 14.99,10.29 v1(14.53,10.75) ; C8.2 10.92,4.54 v1(10.88,4.58) ; C9.2 17.18,4.18 R7.1 ; LDO1.5 16.76,0.96 16.89,1.09 C5.2 18.19,1.21 R16.2 R17.2 R19.2 R18.2 26.68,1.1 U4.5 28.19,2.61 v1(28.19,3.69)
5V: length 26
  Top Layer w0.254: U3.1 26.01,0.43 16.22,0.43 15.62,1.02 v1(13.59,1.02)
  Bottom Layer w0.381: 9.52,3.18 9.9,3.56 11.46,3.56 LDO1.3 13.48,2.86 13.59,2.75 ; 13.59,2.75 13.59,3.89 R12.2 ; 13.59,2.75 v1(13.59,1.02) 13.53,0.96 LDO1.1 12.03,0.83 C4.2
GND: length 71.4
  Top Layer w0.254: PWR.1 17.99,3.18 v1(17.53,3.18) 17.15,3.18 16.47,3.85 U1.47 16.47,5.82 15.61,6.69 15.16,6.69 v1(14.86,6.99) ; v1(12.16,7.02) 11.21,7.02 10.96,6.77 U1.35 ; 19.63,12.53 19.63,9.86 19.55,9.77 U1.8
  Top Layer w0.381: v1(28,11.31) U3.5 ; v1(6.96,3.17) 6.96,3.62 USB1.12 ; 11.96,14.51 13.06,14.51 13.47,14.09 U1.20 ; 11.96,14.51 11.97,14.5 U1.23 ; 11.96,14.51 10.95,14.51 v1(10.29,13.85) ; USB1.1 7.52,10.7 8.25,11.44 v1(8.25,11.94)
  Bottom Layer w0.254: C5.1 16.96,2.61 v1(17.53,3.18) ; 15.43,6.99 15.88,6.99 R6.2 15.48,7.04 15.43,6.99 ; 15.43,6.99 14.78,6.34 14.78,6.1 R13.1 14.66,4.2 15.22,4.2 16.09,5.07 C9.1 ; 15.43,6.99 v1(14.86,6.99) ; C7.1 17.9,12.43 R5.1 ; C3.1 19.36,10.77 C2.1 20.32,8.08 20.3,8.06 ; 20.3,8.06 C1.1 ; 20.3,8.06 19.41,8.06 18.47,7.12 ; U4.2 26.92,10.04 25.91,11.06 25.91,13.36 24.91,14.36 15.11,14.36 14.66,13.9 10.34,13.9 v1(10.29,13.85) ; C8.1 12.16,6.11 v1(12.16,7.02)
  Bottom Layer w0.381: v1(10.29,13.85) 9.82,13.38 C6.1 8.8,13.38 8.25,12.83 v1(8.25,11.94) ; C4.1 11.11,1.91 LDO1.2 ; 18.47,7.12 18.47,6.1 ; C3.1 C7.1 ; U4.2 v1(28,11.31)
  vias: v1(1.91,9.15) v1(1.91,7.81) v1(1.91,6.15) v1(12.57,8.39) v1(19.89,10.08) v1(29.21,11.31)
DN: length 2.9
  Top Layer w0.254: U1.32 10.92,8.27 v1(11.18,8.53)
  Bottom Layer w0.254: v1(11.18,8.53) 9.63,8.53 R10.2
DP: length 3
  Top Layer w0.254: U1.33 11.09,7.77 v1(11.18,7.69)
  Bottom Layer w0.254: v1(11.18,7.69) 11.11,7.75 9.83,7.75 R9.2
NET15: length 4.5
  Top Layer w0.254: U1.25 12.58,11.77 v1(12.84,11.51)
  Bottom Layer w0.254: v1(12.84,11.51) 11.71,11.51 R8.2
NRST: length 15.3
  Top Layer w0.254: v1(27.31,13.6) 26.6,14.3 14.8,14.3 14.47,13.97 U1.18
  Bottom Layer w0.254: U4.1 27.31,13.28 v1(27.31,13.6)
OSC_IN: length 6.1
  Top Layer w0.254: v1(20.96,6.99) 20,7.95 19.5,7.95 19.26,8.19 19.25,8.19 19.16,8.27 U1.5
  Bottom Layer w0.254: C1.2 20.92,6.95 v1(20.96,6.99) 23.22,6.99 23.31,6.9
  Bottom Layer w0.381: 23.31,6.9 X2.2
OSC_OUT: length 8.3
  Top Layer w0.254: v1(20.96,11.82) 20.96,9.41 20.32,8.77 U1.6
  Bottom Layer w0.254: C2.2 20.92,11.86 v1(20.96,11.82) 23.14,11.82 23.27,11.94
  Bottom Layer w0.381: 23.31,11.91 X2.1
RX: length 26.2
  Top Layer w0.254: RX.1 21.29,3.14 21.84,3.69 24.76,3.69 25.78,4.71 25.78,6.86 26.03,7.12 v1(26.03,8.52) ; U1.13 17.52,13.27 18.05,13.8 25.32,13.8 26.14,12.98 26.14,11.43 27.53,10.04 U3.4 28,8.96 v1(27.94,8.9)
  Bottom Layer w0.254: v1(27.94,8.9) 27.56,8.52 v1(26.03,8.52)
STL_LED: length 13.7
  Top Layer w0.254: STL_STA.1 18.8,3.9 18.8,4.75 16.26,7.29 16.26,8.52 15.49,9.28 9.98,9.28 U1.30
STL_NRST: length 4.4
  Top Layer w0.254: v1(16.64,9.63) 17.05,9.63 17.4,9.27 U1.7
  Bottom Layer w0.254: v1(16.64,9.63) 17.04,9.63 17.61,9.06 17.65,9.1 18.78,9.1 C3.2
STL_SWCLK: length 5.3
  Top Layer w0.254: U1.37 11.47,3.99 8.76,1.28 H1.1
STL_SWDIO: length 9.2
  Top Layer w0.254: H1.2 6.86,2.55 8.38,2.55 8.94,3.11 8.94,7.02 9.2,7.27 U1.34
SWCLK: length 31.6
  Top Layer w0.254: U1.15 15.97,12.42 15.54,11.99 15.54,10.7 14.63,9.79 13.69,9.79 v1(12.72,10.75) 12.2,11.27 U1.26
  Bottom Layer w0.254: U4.3 26.16,7.5 25.38,8.29 25.38,12.98 24.46,13.9 15.67,13.9 15.14,13.37 15.14,12.81 13.08,10.75 v1(12.72,10.75)
SWDIO: length 28.4
  Top Layer w0.254: U1.27 11.59,10.77 v1(12.19,10.17)
  Bottom Layer w0.254: R8.1 11.63,10.17 v1(12.19,10.17) 13,10.17 15.49,12.66 15.49,13.22 15.82,13.55 24.31,13.55 25.02,12.83 25.02,5.98 26.03,4.96 U4.4
TX: length 23
  Top Layer w0.254: TX.1 25.11,2.89 26.14,3.92 26.14,6.08 27.56,7.5 27.93,7.5 ; 27.93,7.5 25.78,9.65 25.78,12.71 25.07,13.42 19.76,13.42 18.47,12.13 U1.12 ; 27.93,7.5 U3.3
USB_RENUM: length 4.1
  Top Layer w0.254: U1.38 11.97,5.58 12.19,5.8 13.42,5.8 14.1,6.48 v1(14.1,6.61)
  Bottom Layer w0.254: v1(14.1,6.61) 14.1,6.43 R14.2
$1N527: length 4.4
  Top Layer w0.254: U1.2 17.62,6.77 16.84,7.56 v1(16.84,7.87)
  Bottom Layer w0.254: R1.2 17.6,6.17 16.84,6.93 v1(16.84,7.87)
$1N531: length 4.8
  Top Layer w0.254: v1(16.76,8.86) 17.44,8.18 17.44,7.6 17.77,7.27 U1.3
  Bottom Layer w0.254: R2.2 17.6,8.03 v1(16.76,8.86)
$1N1130: length 3.6
  Top Layer w0.254: v1(16.64,11.06) 16.92,10.77 U1.10
  Bottom Layer w0.254: R5.2 R4.1 16.29,11.41 v1(16.64,11.06)
$1N1287: length 2.1
  Top Layer w0.254: v1(15.37,6.1) 14.97,5.71 U1.44
  Bottom Layer w0.254: v1(15.37,6.1) 15.86,6.1 15.93,6.17
$1N1308: length 5
  Top Layer w0.254: U1.39 12.47,3.79 12.69,3.57 v1(15.5,3.57)
  Bottom Layer w0.254: R7.2 16,4.07 v1(15.5,3.57)
$1N1874: length 10.1
  Top Layer w0.381: v1(7.75,4.07) 7.75,4.71 7.35,5.1 USB1.11 ; 5.88,5.1 5.29,5.1 3.81,6.58 3.81,8.42 5.29,9.9 5.88,9.9
  Bottom Layer w0.381: v1(7.75,4.07) 8.01,3.81 F1.1
$1N1927: length 5.6
  Top Layer w0.254: USB1.6 7.37,7.75 7.75,7.37 v1(7.75,7.25) 7.75,7.12 7.38,6.75 USB1.8
  Bottom Layer w0.254: v1(7.75,7.25) 8.46,7.25 R9.1 R11.1
$1N1932: length 5.9
  Top Layer w0.254: v1(8,8.26) 7.99,8.25 USB1.5 5.21,8.25 4.95,8 4.95,7.5 5.2,7.25 USB1.7
  Bottom Layer w0.381: v1(8,8.26) 8.39,8.26 R10.1
$1N2093: length 5.7
  Bottom Layer w0.254: R11.2 10.2,7.11 11.42,7.11 11.76,7.45 11.76,8.85 12.25,9.34 Q1.2
$1N2214: length 3.5
  Bottom Layer w0.381: Q1.1 12.9,7.09 R14.1 R13.2 R12.1
$1N2319: length 8.6
  Top Layer w0.254: v1(7.75,5.75) USB1.10 6.25,5.72 5.31,5.72 4.32,6.71 4.32,8.14 4.93,8.75 USB1.4
  Bottom Layer w0.254: R15.2 8.43,5.75 v1(7.75,5.75)
$1N2779: length 1.5
  Top Layer w0.254: PWR.2 18.33,1.29 v1(18.95,1.91)
  Bottom Layer w0.254: v1(18.95,1.91) 18.55,1.91 18.43,2.04
$1N2890: length 1.5
  Top Layer w0.254: STL_STA.2 19.81,1.4 v1(20.37,1.96)
  Bottom Layer w0.254: R17.1 v1(20.37,1.96)
$1N2985: length 1.7
  Top Layer w0.254: TX.2 23.44,1.91 v1(23.5,1.91)
  Bottom Layer w0.254: v1(23.5,1.91) 22.91,1.91 22.86,1.86 R18.1
$1N3080: length 1.6
  Top Layer w0.254: RX.2 21.3,1.3 v1(21.96,1.96)
  Bottom Layer w0.254: R19.1 v1(21.96,1.96)

## Copper pours and planes (outline as drawn; the poured copper is in the pictures)
GND on Top Layer: -1.65,17.41 32.77,17.41 32.77,-3.3 -1.65,-3.3
GND on Bottom Layer: -1.78,16.01 31.62,16.01 31.62,-1.52 -1.78,-1.52

Small or netless copper shapes (teardrops, artwork), in the pictures only: 78 on Top Layer, 136 on Bottom Layer

## Text on the board
Bottom Silkscreen Layer: R | G | CK | IO | 3V3
Top Silkscreen Layer: G | IO | CK | STA | 3V3 | GND | 5V | RX | TX

# Board PCB2
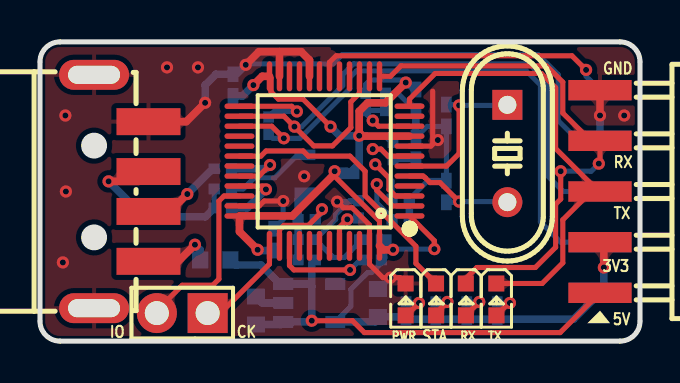
[diagram p4: board, top side]
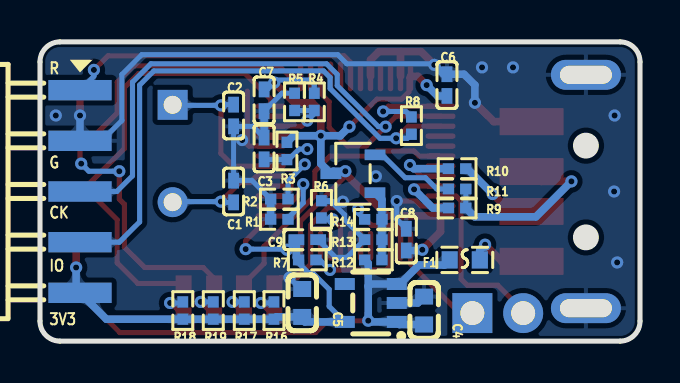
[diagram p5: board, bottom side, seen from below]

Outline 30 x 15 mm; copper layers: Top Layer, Bottom Layer. Coordinates in mm from the lower left corner of the outline.
Outline path: 0,14 0,1 arc(0.29,0.29) 1,0 29,0 arc(29.71,0.29) 30,1 30,14 arc(29.71,14.71) 29,15 1,15 arc(0.29,14.71) 0,14
Stack: Top Layer 0.035mm / Dielectric1 1.51mm FR4 er 4.5 / Bottom Layer 0.035mm

## Design rules (mm)
template: JLCPCB Capability(Two Layers Board)
spacing copperThickness1oz (default): track to track 0.102, other pairs 0.152 to 0.3
spacing copperThickness2oz: track to track 0.203, other pairs 0.152 to 0.3
track width copperThickness1oz (default): min 0.127, default 0.254, max 2.54
track width copperThickness2oz: min 0.203, default 0.254, max 2.54
differential pair differentialPair (default): width min 0.127, default 0.254, max 2.54; gap min 0.152, default 0.152
via viaSize (default): diameter min 0.5, default 0.61, max 10; hole min 0.3, default 0.305, max 6.3

## Placement (name value [footprint] x y rotation side)
C1  20pF  [C0402]  20.32 7.5 270 bottom
C2  20pF  [C0402]  20.32 11.31 90 bottom
C3  100nF  [C0402]  18.8 9.66 270 bottom
C4  1uF  [C0603]  10.79 1.53 270 bottom
C5  1uF  [C0603]  16.89 1.91 270 bottom
C6  100nF  [C0402]  9.65 12.83 270 bottom
C7  100nF  [C0402]  18.8 12.07 90 bottom
C8  100nF  [C0402]  11.68 5.09 270 bottom
C9  100nF  [C0402]  16.64 5.09 0 bottom
F1  MF-FSMF050X-2  [F0603]  8.76 4.07 0 bottom
H2  PZ254V-11-02P  [HDR-TH_2P-P2.54-V-M]  7.11 1.4 180 top
LDO1  ME6211C33M5G-N  [SOT-23-5_L3.0-W1.7-P0.95-LS2.8-BR]  13.46 1.91 180 bottom
PWR  -  [LED_0603]  18.29 2.04 270 top
Q1  S8050  [SOT-23-3_L3.0-W1.7-P0.95-LS2.9-BR]  14.35 8.39 180 bottom
R1  10kΩ  [R0402]  18.03 6.1 180 bottom
R2  10kΩ  [R0402]  18.03 7.12 180 bottom
R3  100kΩ  [R0402]  17.65 9.53 90 bottom
R4  4.7kΩ  [R0402]  16.29 11.99 90 bottom
R5  4.7kΩ  [R0402]  17.27 11.99 270 bottom
R6  10kΩ  [R0402]  15.93 6.61 90 bottom
R7  4.7kΩ  [R0402]  16.64 4.07 180 bottom
R8  100Ω  [R0402]  11.43 10.8 90 bottom
R9  10Ω  [R0402]  9.14 6.67 0 bottom
R10  10Ω  [R0402]  9.14 8.64 0 bottom
R11  1.5kΩ  [R0402]  9.14 7.63 0 bottom
R12  10kΩ  [R0402]  13.34 4.07 0 bottom
R13  36kΩ  [R0402]  13.34 5.09 180 bottom
R14  100Ω  [R0402]  13.34 6.1 0 bottom
R16  1kΩ  [R0402]  18.3 1.53 270 bottom
R17  1kΩ  [R0402]  19.79 1.53 270 bottom
R18  510Ω  [R0402]  22.86 1.53 270 bottom
R19  510Ω  [R0402]  21.34 1.53 270 bottom
RX  -  [LED_0603]  21.3 2.04 270 top
STA  -  [LED_0603]  19.81 2.04 270 top
TX  -  [LED_0603]  22.83 2.04 270 top
U1  STM32F103CBT6  [LQFP-48_L7.0-W7.0-P0.50-LS9.0-BL]  14.22 9.02 90 top
U3  X6511WRS-05H-C60D48  [HDR-SMD_5P-P2.54-H-M-W13.3-N]  28 7.5 90 top
U4  X6511WRS-05H-C60D48  [HDR-SMD_5P-P2.54-H-M-W13.3-N]  28 7.5 270 bottom
USB2  AM 180°  [USB-SMD_AM180]  4.06 7.5 270 top
X2  8MHz  [HC-49US_L11.5-W4.5-P4.88]  23.37 9.41 270 top

## Footprints (pads in the part's own frame, mm; a bottom-side part is the same pattern mirrored in y, then rotated)
C0402
  rect 0.79x0.54 smd: 1(-0.545,0) 2(0.545,0)
C0603
  rect 0.8x0.9 smd: 1(-0.7,0) 2(0.7,0)
F0603
  rect 0.806x0.864 smd: 1(-0.753,0) 2(0.753,0)
HC-49US_L11.5-W4.5-P4.88
  rect 1.5x1.5 hole 0.9: 1(-2.44,0)
  round 1.5 hole 0.9: 2(2.44,0)
HDR-SMD_5P-P2.54-H-M-W13.3-N
  rect 1.02x3.16 smd: 1(-5.08,0) 2(-2.54,0) 3(0,0) 4(2.54,0) 5(5.08,0)
HDR-TH_2P-P2.54-V-M
  rect 2x2 hole 1.2: 1(-1.27,0)
  round 2 hole 1.2: 2(1.27,0)
LED_0603
  rect 0.8x0.8 smd: 1(-0.851,-0.01) 2(0.75,-0.005)
LQFP-48_L7.0-W7.0-P0.50-LS9.0-BL
  oval 0.27x1.5 smd: 1(-2.75,-4.25) 2(-2.25,-4.25) 3(-1.75,-4.25) 4(-1.25,-4.25) 5(-0.75,-4.25) 6(-0.25,-4.25) 7(0.25,-4.25) 8(0.75,-4.25) 9(1.25,-4.25) 10(1.75,-4.25) 11(2.25,-4.25) 12(2.75,-4.25) 25(2.75,4.25) 26(2.25,4.25) 27(1.75,4.25) 28(1.25,4.25) 29(0.75,4.25) 30(0.25,4.25) 31(-0.25,4.25) 32(-0.75,4.25) 33(-1.25,4.25) 34(-1.75,4.25) 35(-2.25,4.25) 36(-2.75,4.25)
  oval 1.5x0.27 smd: 13(4.25,-2.75) 14(4.25,-2.25) 15(4.25,-1.75) 16(4.25,-1.25) 17(4.25,-0.75) 18(4.25,-0.25) 19(4.25,0.25) 20(4.25,0.75) 21(4.25,1.25) 22(4.25,1.75) 23(4.25,2.25) 24(4.25,2.75) 37(-4.25,2.75) 38(-4.25,2.25) 39(-4.25,1.75) 40(-4.25,1.25) 41(-4.25,0.75) 42(-4.25,0.25) 43(-4.25,-0.25) 44(-4.25,-0.75) 45(-4.25,-1.25) 46(-4.25,-1.75) 47(-4.25,-2.25) 48(-4.25,-2.75)
R0402
  rect 0.566x0.54 smd: 1(-0.433,0) 2(0.433,0)
SOT-23-3_L3.0-W1.7-P0.95-LS2.9-BR
  rect 1.038x0.532 smd: 1(1.101,-0.95) 2(1.101,0.95) 3(-1.101,0)
SOT-23-5_L3.0-W1.7-P0.95-LS2.8-BR
  rect 1x0.6 smd: 1(1.3,-0.95) 2(1.3,0) 3(1.3,0.95) 4(-1.3,0.95) 5(-1.3,-0.95)
USB-SMD_AM180
  rect 1.35x3.2 smd: 1(3.5,1.36) 2(1,1.36) 3(-1,1.36) 4(-3.5,1.36)
  oval 1.5x3.5 hole 0.9x2.6: 5(-5.85,-1.36) 5(5.85,-1.36)

## Nets
As in the schematic.

Pads without a net: LDO1 4; U1 4 11 14 16 17 19 21 22 28 29 31 40 41 42 43 45 46

## Via types
v1: diameter 0.61, hole 0.305, Top Layer to Bottom Layer, 48 vias

## Routing (per net, layer and track width the routed paths; a pad name or vN(x,y) marks a point on that pad's centre or on a via; arc(x,y) is an arc through that point)
3V3: length 63.9
  Top Layer w0.254: U1.1 19.72,5.03 v1(19.72,4.61) ; v1(14.53,10.75) 13.15,12.13 11.92,12.13 11.55,12.49 11.55,13.19 U1.24 ; 14.73,8.39 14.73,8.26 16.97,6.02 U1.48
  Top Layer w0.381: U1.9 15.98,10.27 v1(15.96,10.29) 15.96,11.52 16.38,11.94 17.27,11.94 v1(18.29,12.96) ; U3.2 28.19,4.77 v1(28.19,3.69) ; v1(10.67,12.83) 11.11,13.27 U1.24 ; U1.48 17.17,4.58 v1(17.65,4.58) ; v1(14.73,8.52) 14.73,8.39 12.62,6.27 U1.36 9.97,5.49 v1(10.88,4.58)
  Bottom Layer w0.254: R7.1 17.15,3.99 16.59,3.44 16.38,3.44 15.54,2.59 15.54,1.74 LDO1.5 ; R4.2 16.29,12.87 16.5,13.09 18.16,13.09 v1(18.29,12.96) 18.63,12.62 C7.2 ; v1(19.72,4.61) 17.69,4.61 v1(17.65,4.58) 17.18,5.05
  Bottom Layer w0.381: C8.2 10.92,4.54 v1(10.88,4.58) ; R3.2 17.32,10.29 v1(15.96,10.29) ; R7.1 17.18,4.18 C9.2 ; C6.2 10.12,12.29 v1(10.67,12.83) ; v1(28.19,3.69) 28.19,2.61 U4.5 26.68,1.1 R18.2 R19.2 R17.2 R16.2 18.19,1.21 C5.2 16.89,1.09 16.76,0.96 LDO1.5 ; v1(14.53,10.75) 14.99,10.29 v1(15.96,10.29) ; v1(14.73,8.52) 15.33,8.52 Q1.3 15.96,8.9 v1(15.96,10.29)
5V: length 26.1
  Top Layer w0.254: U3.1 26.01,0.43 16.22,0.43 15.62,1.02 v1(13.59,1.02)
  Bottom Layer w0.381: F1.2 9.77,3.82 11.05,3.82 12,2.86 LDO1.3 13.48,2.86 13.59,2.75 ; 13.59,2.75 13.59,3.89 R12.2 ; 13.59,2.75 v1(13.59,1.02) 13.53,0.96 LDO1.1 12.03,0.83 C4.2
GND: length 70.5
  Top Layer w0.254: v1(14.86,6.99) 15.16,6.69 15.61,6.69 16.47,5.82 U1.47 16.47,3.85 17.15,3.18 v1(17.53,3.18) 17.99,3.18 PWR.1 ; 19.63,12.53 19.63,9.86 19.55,9.77 U1.8 ; v1(12.16,7.02) 11.21,7.02 10.96,6.77 U1.35
  Top Layer w0.381: v1(8.25,11.94) 7.31,11 USB2.4 ; 11.96,14.51 11.97,14.5 U1.23 ; 11.96,14.51 13.06,14.51 13.47,14.09 U1.20 ; 11.96,14.51 10.95,14.51 v1(10.29,13.85) ; v1(28,11.31) U3.5
  Bottom Layer w0.254: C3.1 19.36,10.77 C2.1 20.32,8.08 20.3,8.06 ; 20.3,8.06 C1.1 ; 20.3,8.06 19.41,8.06 18.47,7.12 ; C7.1 17.9,12.43 R5.1 ; C8.1 12.16,6.11 v1(12.16,7.02) ; v1(14.86,6.99) 15.43,6.99 ; 15.43,6.99 15.48,7.04 R6.2 15.88,6.99 15.43,6.99 ; 15.43,6.99 14.78,6.34 14.78,6.1 R13.1 14.66,4.2 15.22,4.2 16.09,5.07 C9.1 ; v1(10.29,13.85) 10.34,13.9 14.66,13.9 15.11,14.36 24.91,14.36 25.91,13.36 25.91,11.06 26.92,10.04 U4.2 ; C5.1 16.96,2.61 v1(17.53,3.18)
  Bottom Layer w0.381: 18.47,7.12 18.47,6.1 ; v1(8.25,11.94) 8.25,12.83 8.8,13.38 C6.1 9.82,13.38 v1(10.29,13.85) ; C4.1 11.11,1.91 LDO1.2 ; U4.2 v1(28,11.31) ; C3.1 C7.1
  vias: v1(1.14,3.94) v1(1.27,11.31) v1(1.29,7.5) v1(6.35,13.72) v1(7.9,13.72) v1(13.21,8.26) v1(19.89,10.08) v1(29.21,11.31)
DN: length 3.8
  Top Layer w0.254: v1(11.5,8.83) 10.95,8.27 U1.32
  Bottom Layer w0.381: v1(11.5,8.83) 11.31,8.64 R10.2
DP: length 3.5
  Top Layer w0.254: U1.33 11.13,7.77 v1(11.3,7.61)
  Bottom Layer w0.381: R9.2 10.36,6.67 v1(11.3,7.61)
NET15: length 4.5
  Top Layer w0.254: U1.25 12.58,11.77 v1(12.84,11.51)
  Bottom Layer w0.254: R8.2 11.71,11.51 v1(12.84,11.51)
NRST: length 15.3
  Top Layer w0.254: v1(27.31,13.6) 26.6,14.3 14.8,14.3 14.47,13.97 U1.18
  Bottom Layer w0.254: v1(27.31,13.6) 27.31,13.28 U4.1
OSC_IN: length 6.1
  Top Layer w0.254: U1.5 19.16,8.27 19.25,8.19 19.26,8.19 19.5,7.95 20,7.95 v1(20.96,6.99)
  Bottom Layer w0.254: C1.2 20.92,6.95 v1(20.96,6.99) 23.22,6.99 23.31,6.9
  Bottom Layer w0.381: 23.31,6.9 X2.2
OSC_OUT: length 8.3
  Top Layer w0.254: v1(20.96,11.82) 20.96,9.41 20.32,8.77 U1.6
  Bottom Layer w0.254: C2.2 20.92,11.86 v1(20.96,11.82) 23.14,11.82 23.27,11.94
  Bottom Layer w0.381: 23.31,11.91 X2.1
RX: length 26.2
  Top Layer w0.254: U1.13 17.52,13.27 18.05,13.8 25.32,13.8 26.14,12.98 26.14,11.43 27.53,10.04 U3.4 28,8.96 v1(27.94,8.9) ; v1(26.03,8.52) 26.03,7.12 25.78,6.86 25.78,4.71 24.76,3.69 21.84,3.69 21.29,3.14 RX.1
  Bottom Layer w0.254: v1(26.03,8.52) 27.56,8.52 v1(27.94,8.9)
STL_LED: length 13.9
  Top Layer w0.254: U1.30 11.04,9.27 11.3,9.53 13.16,9.53 13.42,9.27 15.5,9.27 16.26,8.52 16.26,7.29 18.8,4.75 18.8,3.9 STA.1
STL_NRST: length 4.4
  Top Layer w0.254: U1.7 17.4,9.27 17.05,9.63 v1(16.64,9.63)
  Bottom Layer w0.254: C3.2 18.78,9.1 17.65,9.1 17.61,9.06 17.04,9.63 v1(16.64,9.63)
STL_SWCLK: length 5
  Top Layer w0.254: U1.37 11.47,3.86 9.02,1.4 H2.1
STL_SWDIO: length 9.2
  Top Layer w0.254: 5.59,1.28 7.11,2.8 8.64,2.8 8.94,3.11 8.94,7.02 9.2,7.27 U1.34
SWCLK: length 31.6
  Top Layer w0.254: U1.15 15.97,12.42 15.54,11.99 15.54,10.7 14.63,9.79 13.69,9.79 v1(12.72,10.75) 12.2,11.27 U1.26
  Bottom Layer w0.254: v1(12.72,10.75) 13.08,10.75 15.14,12.81 15.14,13.37 15.67,13.9 24.46,13.9 25.38,12.98 25.38,8.29 26.16,7.5 U4.3
SWDIO: length 28.4
  Top Layer w0.254: v1(12.19,10.17) 11.59,10.77 U1.27
  Bottom Layer w0.254: R8.1 11.63,10.17 v1(12.19,10.17) 13,10.17 15.49,12.66 15.49,13.22 15.82,13.55 24.31,13.55 25.02,12.83 25.02,5.98 26.03,4.96 U4.4
TX: length 23
  Top Layer w0.254: U1.12 18.47,12.13 19.76,13.42 25.07,13.42 25.78,12.71 25.78,9.65 27.93,7.5 ; 27.93,7.5 27.56,7.5 26.14,6.08 26.14,3.92 25.11,2.89 TX.1 ; 27.93,7.5 U3.3
USB_RENUM: length 4.1
  Top Layer w0.254: U1.38 11.97,5.58 12.19,5.8 13.42,5.8 14.1,6.48 v1(14.1,6.61)
  Bottom Layer w0.254: v1(14.1,6.61) 14.1,6.43 R14.2
$1N2138: length 4.4
  Top Layer w0.254: v1(16.84,7.87) 16.84,7.56 17.62,6.77 U1.2
  Bottom Layer w0.254: v1(16.84,7.87) 16.84,6.93 17.6,6.17 R1.2
$1N2139: length 4.8
  Top Layer w0.254: U1.3 17.77,7.27 17.44,7.6 17.44,8.18 v1(16.76,8.86)
  Bottom Layer w0.254: R2.2 17.6,8.03 v1(16.76,8.86)
$1N2152: length 3.6
  Top Layer w0.254: v1(16.64,11.06) 16.92,10.77 U1.10
  Bottom Layer w0.254: R5.2 R4.1 16.29,11.41 v1(16.64,11.06)
$1N2164: length 2.1
  Top Layer w0.254: v1(15.37,6.1) 14.97,5.71 U1.44
  Bottom Layer w0.254: 15.93,6.17 15.86,6.1 v1(15.37,6.1)
$1N2166: length 5
  Top Layer w0.254: v1(15.5,3.57) 12.69,3.57 12.47,3.79 U1.39
  Bottom Layer w0.254: v1(15.5,3.57) 16,4.07 R7.2
$1N2184: length 3.5
  Top Layer w0.381: USB2.1 6.91,4 v1(7.75,4.83)
  Bottom Layer w0.381: F1.1 8.01,4.57 v1(7.75,4.83)
$1N2186: length 4.2
  Top Layer w0.381: v1(7.37,7.37) 6.49,6.5 USB2.2
  Bottom Layer w0.381: R10.1 8.64,8.64 v1(7.37,7.37)
$1N2192: length 4.4
  Bottom Layer w0.254: R11.2 10.16,7.63 10.72,8.19 11.74,8.19 12.89,9.34 Q1.2
$1N2194: length 3.5
  Bottom Layer w0.381: R12.1 R13.2 R14.1 12.9,7.09 Q1.1
$1N2208: length 1.5
  Top Layer w0.254: v1(18.95,1.91) 18.33,1.29 PWR.2
  Bottom Layer w0.254: 18.43,2.04 18.55,1.91 v1(18.95,1.91)
$1N2211: length 1.5
  Top Layer w0.254: STA.2 19.81,1.4 v1(20.37,1.96)
  Bottom Layer w0.254: R17.1 v1(20.37,1.96)
$1N2215: length 1.7
  Top Layer w0.254: v1(23.5,1.91) 23.44,1.91 TX.2
  Bottom Layer w0.254: v1(23.5,1.91) 22.91,1.91 22.86,1.86 R18.1
$1N2219: length 1.6
  Top Layer w0.254: v1(21.96,1.96) 21.3,1.3 RX.2
  Bottom Layer w0.254: R19.1 v1(21.96,1.96)
$1N2547: length 9.4
  Top Layer w0.381: USB2.3 4.93,8.01 v1(3.43,8.01)
  Bottom Layer w0.254: R11.1 8.71,6.67
  Bottom Layer w0.381: R9.1 8.27,6.23 5.21,6.23 v1(3.43,8.01)

## Copper pours and planes (outline as drawn; the poured copper is in the pictures)
GND on Top Layer: -1.27,17.28 31.75,17.28 31.75,-3.04 -1.27,-3.04
GND on Bottom Layer: -3.17,19.44 34.67,19.44 34.67,-6.72 -3.17,-6.72

Small or netless copper shapes (teardrops, artwork), in the pictures only: 76 on Top Layer, 134 on Bottom Layer

## Text on the board
Bottom Silkscreen Layer: R | G | CK | IO | 3V3
Top Silkscreen Layer: IO | CK | STA | 3V3 | GND | 5V | RX | TX
